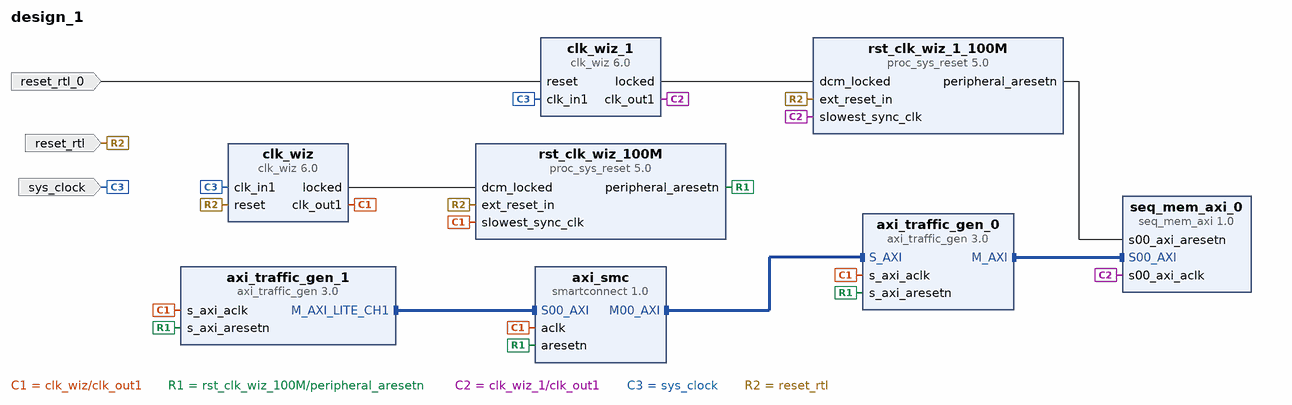
[diagram p0: block diagram of the top level]
# Vivado block design design_1, xc7z010clg400-1, Vivado 2020.1
create_bd_design design_1

create_bd_port -dir I -type clk sys_clock
set_property -dict {CONFIG.FREQ_HZ 125000000 CONFIG.PHASE 0.000} [get_bd_ports sys_clock]
create_bd_port -dir I -type rst reset_rtl
set_property -dict {CONFIG.POLARITY ACTIVE_HIGH} [get_bd_ports reset_rtl]
create_bd_port -dir I -type rst reset_rtl_0
set_property -dict {CONFIG.POLARITY ACTIVE_HIGH} [get_bd_ports reset_rtl_0]

create_bd_cell -type ip -vlnv xilinx.com:ip:axi_traffic_gen:3.0 axi_traffic_gen_0
set_property -dict {CONFIG.ATG_OPTIONS Custom CONFIG.C_ATG_MODE AXI4} [get_bd_cells axi_traffic_gen_0]
create_bd_cell -type ip -vlnv xilinx.com:ip:axi_traffic_gen:3.0 axi_traffic_gen_1
set_property -dict [list \
  CONFIG.C_ATG_MIF_DATA_DEPTH 32 \
  CONFIG.C_ATG_MODE AXI4-Lite \
  CONFIG.C_ATG_SYSINIT_MODES System_Test \
  CONFIG.C_ATG_SYSTEM_CH1_HIGH 0xFFFFFFFF \
  CONFIG.C_ATG_SYSTEM_CMD_MAX_RETRY 2147483647 \
  CONFIG.C_ATG_SYSTEM_INIT_ADDR_MIF ../../../../new/addr.coe \
  CONFIG.C_ATG_SYSTEM_INIT_CTRL_MIF ../../../../new/ctrl.coe \
  CONFIG.C_ATG_SYSTEM_INIT_DATA_MIF ../../../../new/data.coe \
  CONFIG.C_ATG_SYSTEM_INIT_MASK_MIF ../../../../new/mask.coe \
  CONFIG.C_ATG_SYSTEM_MAX_CHANNELS 1 \
] [get_bd_cells axi_traffic_gen_1]
create_bd_cell -type ip -vlnv xilinx.com:ip:smartconnect:1.0 axi_smc
set_property -dict {CONFIG.NUM_SI 1} [get_bd_cells axi_smc]
create_bd_cell -type ip -vlnv xilinx.com:ip:clk_wiz:6.0 clk_wiz
set_property -dict {CONFIG.CLK_IN1_BOARD_INTERFACE sys_clock CONFIG.USE_BOARD_FLOW true} [get_bd_cells clk_wiz]
create_bd_cell -type ip -vlnv xilinx.com:ip:proc_sys_reset:5.0 rst_clk_wiz_100M
create_bd_cell -type ip -vlnv xilinx.com:ip:clk_wiz:6.0 clk_wiz_1
set_property -dict {CONFIG.CLK_IN1_BOARD_INTERFACE sys_clock CONFIG.USE_BOARD_FLOW true} [get_bd_cells clk_wiz_1]
create_bd_cell -type ip -vlnv xilinx.com:ip:proc_sys_reset:5.0 rst_clk_wiz_1_100M
create_bd_cell -type ip -vlnv xilinx.com:user:seq_mem_axi:1.0 seq_mem_axi_0

# ---- connections ----

connect_bd_intf_net [get_bd_intf_pins axi_traffic_gen_0/M_AXI] [get_bd_intf_pins seq_mem_axi_0/S00_AXI]
connect_bd_intf_net [get_bd_intf_pins axi_traffic_gen_1/M_AXI_LITE_CH1] [get_bd_intf_pins axi_smc/S00_AXI]
connect_bd_intf_net [get_bd_intf_pins axi_smc/M00_AXI] [get_bd_intf_pins axi_traffic_gen_0/S_AXI]
connect_bd_net [get_bd_pins clk_wiz/clk_out1] \
  [get_bd_pins axi_traffic_gen_1/s_axi_aclk] [get_bd_pins axi_smc/aclk] [get_bd_pins rst_clk_wiz_100M/slowest_sync_clk] \
  [get_bd_pins axi_traffic_gen_0/s_axi_aclk]
connect_bd_net [get_bd_pins clk_wiz/locked] [get_bd_pins rst_clk_wiz_100M/dcm_locked]
connect_bd_net [get_bd_pins rst_clk_wiz_100M/peripheral_aresetn] \
  [get_bd_pins axi_traffic_gen_1/s_axi_aresetn] [get_bd_pins axi_traffic_gen_0/s_axi_aresetn] [get_bd_pins axi_smc/aresetn]
connect_bd_net [get_bd_pins clk_wiz_1/clk_out1] [get_bd_pins rst_clk_wiz_1_100M/slowest_sync_clk] [get_bd_pins seq_mem_axi_0/s00_axi_aclk]
connect_bd_net [get_bd_pins clk_wiz_1/locked] [get_bd_pins rst_clk_wiz_1_100M/dcm_locked]
connect_bd_net [get_bd_pins rst_clk_wiz_1_100M/peripheral_aresetn] [get_bd_pins seq_mem_axi_0/s00_axi_aresetn]
connect_bd_net [get_bd_ports sys_clock] [get_bd_pins clk_wiz/clk_in1] [get_bd_pins clk_wiz_1/clk_in1]
connect_bd_net [get_bd_ports reset_rtl] \
  [get_bd_pins clk_wiz/reset] [get_bd_pins rst_clk_wiz_1_100M/ext_reset_in] [get_bd_pins rst_clk_wiz_100M/ext_reset_in]
connect_bd_net -net reset_rtl_0_1 [get_bd_ports reset_rtl_0] [get_bd_pins clk_wiz_1/reset]

# ---- address map ----
assign_bd_address -offset 0x44A00000 -range 64K -target_address_space [get_bd_addr_spaces axi_traffic_gen_1/Reg1] [get_bd_addr_segs axi_traffic_gen_0/S_AXI/Reg0]

validate_bd_design
save_bd_design
